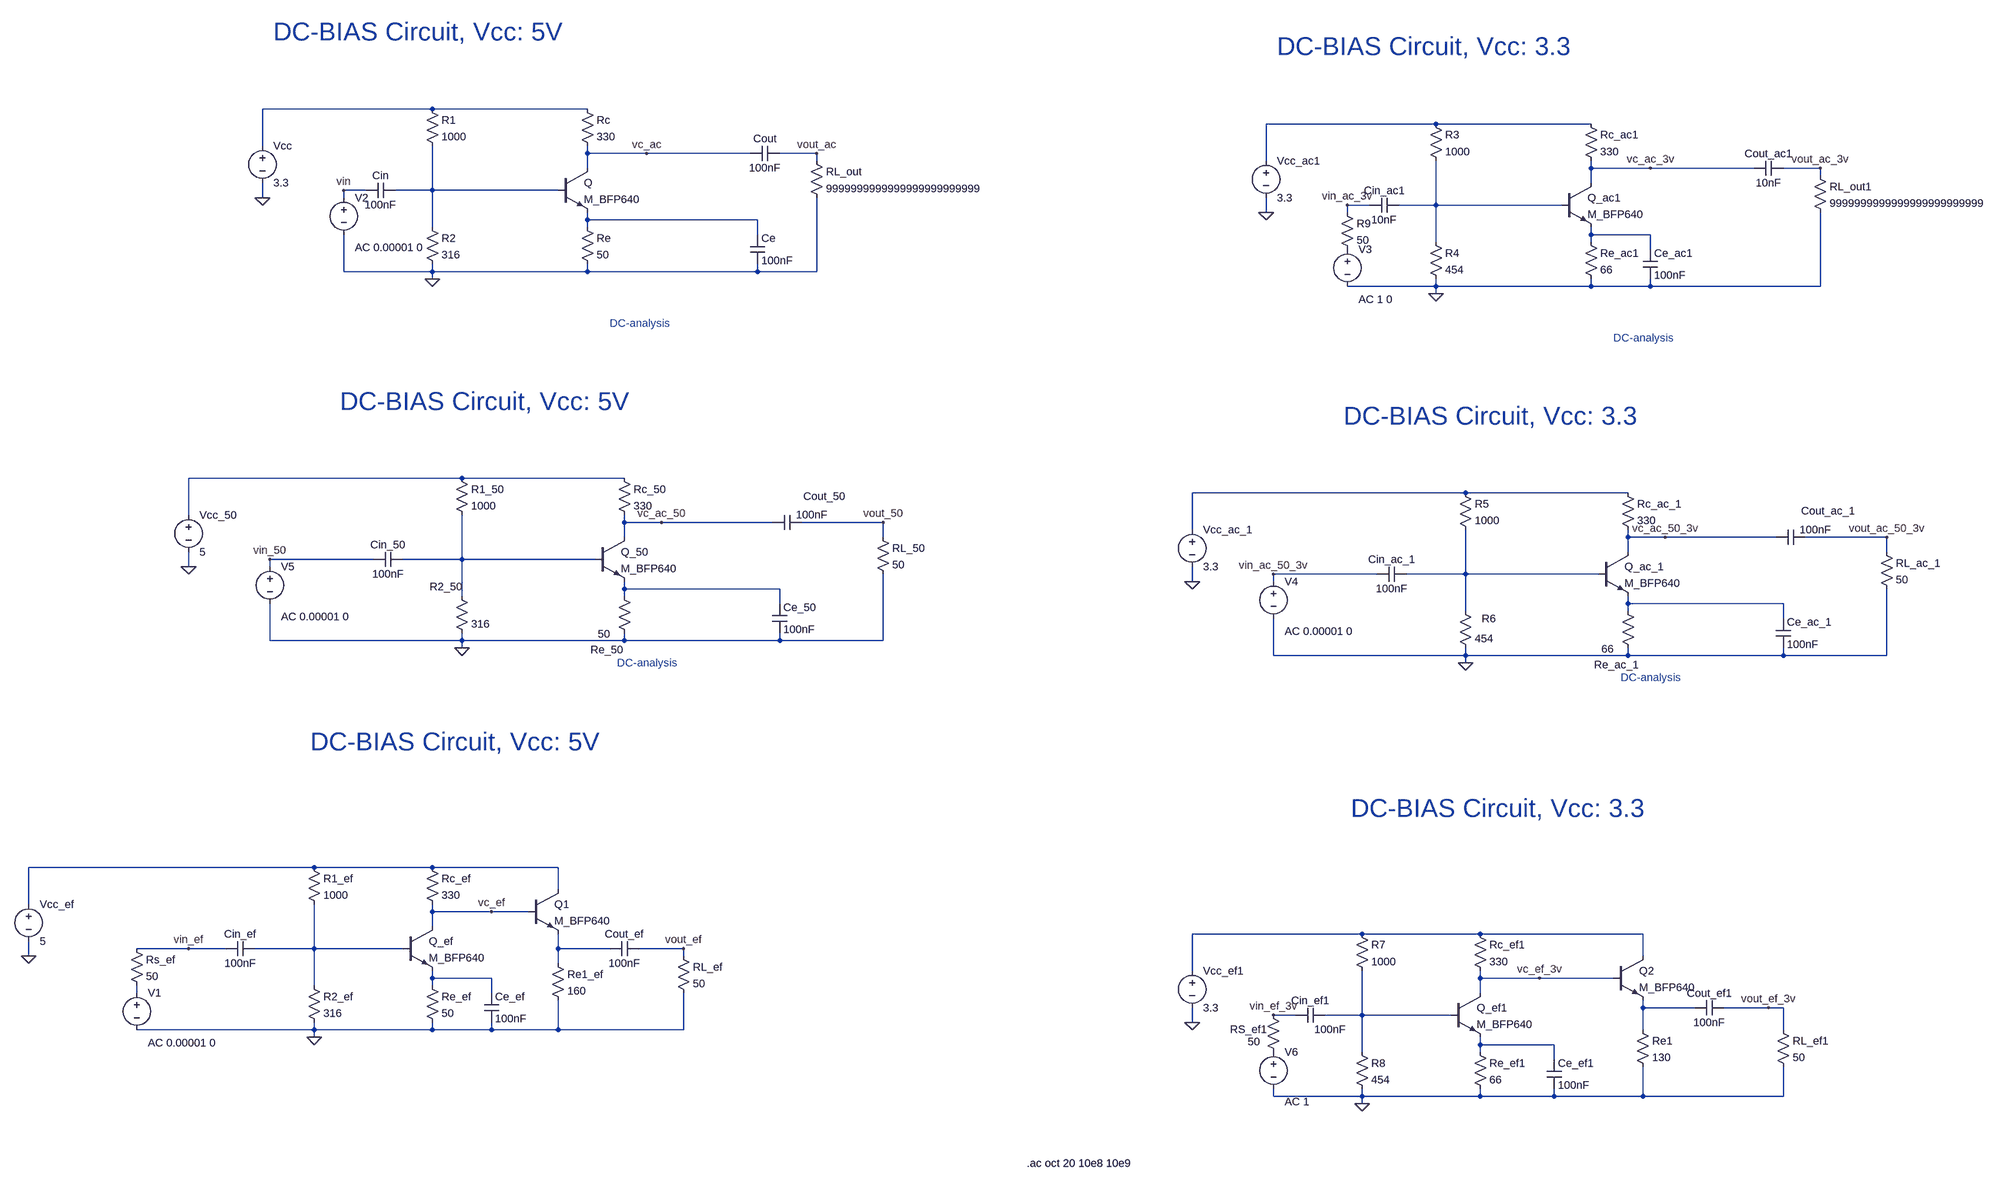
[diagram p0: schematic BP640_FREQ.asc]
BP640_FREQ.asc, the LTspice schematic file:
Version 4
SHEET 1 2820 2688
WIRE -2048 -608 -2416 -608
WIRE -1712 -608 -2048 -608
WIRE 1632 -576 1264 -576
WIRE 1968 -576 1632 -576
WIRE -2416 -528 -2416 -608
WIRE -1712 -512 -1712 -528
WIRE -1584 -512 -1712 -512
WIRE -1360 -512 -1584 -512
WIRE -1216 -512 -1296 -512
WIRE -1216 -496 -1216 -512
WIRE 1264 -496 1264 -576
WIRE -1712 -480 -1712 -512
WIRE 1968 -480 1968 -496
WIRE 2096 -480 1968 -480
WIRE 2320 -480 2096 -480
WIRE 2464 -480 2384 -480
WIRE 2464 -464 2464 -480
WIRE 1968 -448 1968 -480
WIRE -2192 -432 -2240 -432
WIRE -2048 -432 -2048 -528
WIRE -2048 -432 -2128 -432
WIRE -1776 -432 -2048 -432
WIRE -2416 -416 -2416 -448
WIRE -2240 -416 -2240 -432
WIRE 1488 -400 1440 -400
WIRE 1632 -400 1632 -496
WIRE 1632 -400 1552 -400
WIRE 1904 -400 1632 -400
WIRE 1264 -384 1264 -416
WIRE 1440 -384 1440 -400
WIRE -1712 -368 -1712 -384
WIRE -1344 -368 -1712 -368
WIRE -2048 -352 -2048 -432
WIRE -1712 -352 -1712 -368
WIRE -1344 -336 -1344 -368
WIRE 1968 -336 1968 -352
WIRE 2096 -336 1968 -336
WIRE 1632 -320 1632 -400
WIRE 1968 -320 1968 -336
WIRE 2096 -304 2096 -336
WIRE -2240 -256 -2240 -336
WIRE -2048 -256 -2048 -272
WIRE -2048 -256 -2240 -256
WIRE -1712 -256 -1712 -272
WIRE -1712 -256 -2048 -256
WIRE -1344 -256 -1344 -272
WIRE -1344 -256 -1712 -256
WIRE -1216 -256 -1216 -416
WIRE -1216 -256 -1344 -256
WIRE -2048 -240 -2048 -256
WIRE 1632 -224 1632 -240
WIRE 1632 -224 1440 -224
WIRE 1968 -224 1968 -240
WIRE 1968 -224 1632 -224
WIRE 2096 -224 2096 -240
WIRE 2096 -224 1968 -224
WIRE 2464 -224 2464 -384
WIRE 2464 -224 2096 -224
WIRE 1632 -208 1632 -224
WIRE -1984 720 -2576 720
WIRE -1632 720 -1984 720
WIRE 1696 752 1104 752
WIRE 2048 752 1696 752
WIRE -2576 800 -2576 720
WIRE -1632 816 -1632 800
WIRE -1552 816 -1632 816
WIRE -1312 816 -1552 816
WIRE -1072 816 -1248 816
WIRE 1104 832 1104 752
WIRE -1632 848 -1632 816
WIRE -1072 848 -1072 816
WIRE 2048 848 2048 832
WIRE 2128 848 2048 848
WIRE 2368 848 2128 848
WIRE 2608 848 2432 848
WIRE 2048 880 2048 848
WIRE 2608 880 2608 848
WIRE -2176 896 -2400 896
WIRE -1984 896 -1984 800
WIRE -1984 896 -2112 896
WIRE -1696 896 -1984 896
WIRE -2576 912 -2576 880
WIRE -2400 912 -2400 896
WIRE 1504 928 1280 928
WIRE 1696 928 1696 832
WIRE 1696 928 1568 928
WIRE 1984 928 1696 928
WIRE 1104 944 1104 912
WIRE 1280 944 1280 928
WIRE -1632 960 -1632 944
WIRE -1296 960 -1632 960
WIRE -1984 976 -1984 896
WIRE -1632 976 -1632 960
WIRE -1296 992 -1296 960
WIRE 2048 992 2048 976
WIRE 2384 992 2048 992
WIRE 1696 1008 1696 928
WIRE 2048 1008 2048 992
WIRE 2384 1024 2384 992
WIRE -2400 1072 -2400 992
WIRE -1984 1072 -1984 1056
WIRE -1984 1072 -2400 1072
WIRE -1632 1072 -1632 1056
WIRE -1632 1072 -1984 1072
WIRE -1296 1072 -1296 1056
WIRE -1296 1072 -1632 1072
WIRE -1072 1072 -1072 928
WIRE -1072 1072 -1296 1072
WIRE -1984 1088 -1984 1072
WIRE 1280 1104 1280 1024
WIRE 1696 1104 1696 1088
WIRE 1696 1104 1280 1104
WIRE 2048 1104 2048 1088
WIRE 2048 1104 1696 1104
WIRE 2384 1104 2384 1088
WIRE 2384 1104 2048 1104
WIRE 2608 1104 2608 960
WIRE 2608 1104 2384 1104
WIRE 1696 1120 1696 1104
WIRE -2304 1680 -2944 1680
WIRE -2048 1680 -2304 1680
WIRE -1776 1680 -2048 1680
WIRE -1776 1728 -1776 1680
WIRE -2944 1760 -2944 1680
WIRE -2048 1776 -2048 1760
WIRE -1920 1776 -2048 1776
WIRE -1840 1776 -1920 1776
WIRE -2048 1808 -2048 1776
WIRE 1472 1824 1104 1824
WIRE 1728 1824 1472 1824
WIRE 2080 1824 1728 1824
WIRE -2576 1856 -2688 1856
WIRE -2496 1856 -2576 1856
WIRE -2304 1856 -2304 1760
WIRE -2304 1856 -2432 1856
WIRE -2112 1856 -2304 1856
WIRE -1776 1856 -1776 1824
WIRE -1664 1856 -1776 1856
WIRE -1504 1856 -1600 1856
WIRE -2944 1872 -2944 1840
WIRE -1504 1872 -1504 1856
WIRE 2080 1872 2080 1824
WIRE -1776 1888 -1776 1856
WIRE 1104 1904 1104 1824
WIRE -2048 1920 -2048 1904
WIRE -1920 1920 -2048 1920
WIRE 1728 1920 1728 1904
WIRE 1856 1920 1728 1920
WIRE 2016 1920 1856 1920
WIRE -2304 1936 -2304 1856
WIRE -2048 1936 -2048 1920
WIRE -2688 1952 -2688 1936
WIRE -1920 1952 -1920 1920
WIRE 1728 1952 1728 1920
WIRE 2080 1984 2080 1968
WIRE 2192 1984 2080 1984
WIRE 2352 1984 2256 1984
WIRE 2384 1984 2352 1984
WIRE 1328 2000 1280 2000
WIRE 1472 2000 1472 1904
WIRE 1472 2000 1392 2000
WIRE 1664 2000 1472 2000
WIRE 1104 2016 1104 1984
WIRE -2304 2032 -2304 2016
WIRE -2304 2032 -2688 2032
WIRE -2048 2032 -2048 2016
WIRE -2048 2032 -2304 2032
WIRE -1920 2032 -1920 2016
WIRE -1920 2032 -2048 2032
WIRE -1776 2032 -1776 1968
WIRE -1776 2032 -1920 2032
WIRE -1504 2032 -1504 1952
WIRE -1504 2032 -1776 2032
WIRE 2080 2032 2080 1984
WIRE 2384 2032 2384 1984
WIRE -2304 2048 -2304 2032
WIRE 1728 2064 1728 2048
WIRE 1888 2064 1728 2064
WIRE 1472 2080 1472 2000
WIRE 1728 2080 1728 2064
WIRE 1888 2096 1888 2064
WIRE 1280 2176 1280 2160
WIRE 1472 2176 1472 2160
WIRE 1472 2176 1280 2176
WIRE 1728 2176 1728 2160
WIRE 1728 2176 1472 2176
WIRE 1888 2176 1888 2160
WIRE 1888 2176 1728 2176
WIRE 2080 2176 2080 2112
WIRE 2080 2176 1888 2176
WIRE 2384 2176 2384 2112
WIRE 2384 2176 2080 2176
WIRE 1472 2192 1472 2176
FLAG -2416 -416 0
FLAG -2048 -240 0
FLAG -2576 912 0
FLAG -1984 1088 0
FLAG -2400 896 vin_50
FLAG -1072 816 vout_50
FLAG -2240 -432 vin
FLAG -1216 -512 vout_ac
FLAG -1584 -512 vc_ac
FLAG -1552 816 vc_ac_50
FLAG -2944 1872 0
FLAG -2304 2048 0
FLAG -2576 1856 vin_ef
FLAG -1504 1856 vout_ef
FLAG -1920 1776 vc_ef
FLAG 1264 -384 0
FLAG 1632 -208 0
FLAG 1104 944 0
FLAG 1696 1120 0
FLAG 1280 928 vin_ac_50_3v
FLAG 2608 848 vout_ac_50_3v
FLAG 1440 -400 vin_ac_3v
FLAG 2464 -480 vout_ac_3v
FLAG 2096 -480 vc_ac_3v
FLAG 2128 848 vc_ac_50_3v
FLAG 1104 2016 0
FLAG 1472 2192 0
FLAG 1280 2000 vin_ef_3v
FLAG 1856 1920 vc_ef_3v
FLAG 2352 1984 vout_ef_3v
DATAFLAG -1632 816 ""
DATAFLAG -1632 832 ""
DATAFLAG 2048 848 ""
DATAFLAG 2048 864 ""
DATAFLAG 2288 -400 ""
SYMBOL voltage -2240 -432 R0
WINDOW 123 24 124 Left 2
WINDOW 39 0 0 Left 0
SYMATTR Value2 AC 0.00001 0
SYMATTR InstName V2
SYMATTR Value ""
SYMBOL voltage -2416 -544 R0
WINDOW 123 0 0 Left 0
WINDOW 39 0 0 Left 0
SYMATTR InstName Vcc
SYMATTR Value 3.3
SYMBOL npn -1776 -480 R0
SYMATTR InstName Q
SYMATTR Value M_BFP640
SYMBOL res -2064 -624 R0
SYMATTR InstName R1
SYMATTR Value 1000
SYMBOL res -2064 -368 R0
SYMATTR InstName R2
SYMATTR Value 316
SYMBOL res -1728 -368 R0
SYMATTR InstName Re
SYMATTR Value 50
SYMBOL res -1728 -624 R0
SYMATTR InstName Rc
SYMATTR Value 330
SYMBOL res -1232 -512 R0
SYMATTR InstName RL_out
SYMATTR Value 9999999999999999999999999
SYMBOL cap -1360 -336 R0
SYMATTR InstName Ce
SYMATTR Value 100nF
SYMBOL cap -1296 -528 R90
WINDOW 0 0 32 VBottom 2
WINDOW 3 32 32 VTop 2
SYMATTR InstName Cout
SYMATTR Value 100nF
SYMBOL cap -2128 -448 R90
WINDOW 0 0 32 VBottom 2
WINDOW 3 32 32 VTop 2
SYMATTR InstName Cin
SYMATTR Value 100nF
SYMBOL voltage -2576 784 R0
WINDOW 123 0 0 Left 0
WINDOW 39 0 0 Left 0
SYMATTR InstName Vcc_50
SYMATTR Value 5
SYMBOL npn -1696 848 R0
SYMATTR InstName Q_50
SYMATTR Value M_BFP640
SYMBOL res -2000 704 R0
SYMATTR InstName R1_50
SYMATTR Value 1000
SYMBOL res -2000 960 R0
WINDOW 0 -54 -5 Left 2
SYMATTR InstName R2_50
SYMATTR Value 316
SYMBOL res -1648 960 R0
WINDOW 0 -58 132 Left 2
WINDOW 3 -42 98 Left 2
SYMATTR InstName Re_50
SYMATTR Value 50
SYMBOL res -1648 704 R0
SYMATTR InstName Rc_50
SYMATTR Value 330
SYMBOL res -1088 832 R0
SYMATTR InstName RL_50
SYMATTR Value 50
SYMBOL cap -1312 992 R0
SYMATTR InstName Ce_50
SYMATTR Value 100nF
SYMBOL cap -1248 800 R90
WINDOW 0 -25 -49 VBottom 2
WINDOW 3 -16 -22 VTop 2
SYMATTR InstName Cout_50
SYMATTR Value 100nF
SYMBOL cap -2112 880 R90
WINDOW 0 0 32 VBottom 2
WINDOW 3 32 32 VTop 2
SYMATTR InstName Cin_50
SYMATTR Value 100nF
SYMBOL voltage -2400 896 R0
WINDOW 123 24 124 Left 2
WINDOW 39 0 0 Left 0
SYMATTR Value2 AC 0.00001 0
SYMATTR InstName V5
SYMATTR Value ""
SYMBOL voltage -2944 1744 R0
WINDOW 123 0 0 Left 0
WINDOW 39 0 0 Left 0
SYMATTR InstName Vcc_ef
SYMATTR Value 5
SYMBOL npn -2112 1808 R0
SYMATTR InstName Q_ef
SYMATTR Value M_BFP640
SYMBOL res -2320 1664 R0
SYMATTR InstName R1_ef
SYMATTR Value 1000
SYMBOL res -2320 1920 R0
SYMATTR InstName R2_ef
SYMATTR Value 316
SYMBOL res -2064 1920 R0
SYMATTR InstName Re_ef
SYMATTR Value 50
SYMBOL res -2064 1664 R0
SYMATTR InstName Rc_ef
SYMATTR Value 330
SYMBOL res -1520 1856 R0
SYMATTR InstName RL_ef
SYMATTR Value 50
SYMBOL cap -1936 1952 R0
SYMATTR InstName Ce_ef
SYMATTR Value 100nF
SYMBOL cap -1600 1840 R90
WINDOW 0 0 32 VBottom 2
WINDOW 3 32 32 VTop 2
SYMATTR InstName Cout_ef
SYMATTR Value 100nF
SYMBOL cap -2432 1840 R90
WINDOW 0 0 32 VBottom 2
WINDOW 3 32 32 VTop 2
SYMATTR InstName Cin_ef
SYMATTR Value 100nF
SYMBOL npn -1840 1728 R0
SYMATTR InstName Q1
SYMATTR Value M_BFP640
SYMBOL res -1792 1872 R0
SYMATTR InstName Re1_ef
SYMATTR Value 160
SYMBOL voltage -2688 1936 R0
WINDOW 123 24 124 Left 2
WINDOW 39 0 0 Left 0
SYMATTR Value2 AC 0.00001 0
SYMATTR InstName V1
SYMATTR Value ""
SYMBOL res -2704 1840 R0
SYMATTR InstName Rs_ef
SYMATTR Value 50
SYMBOL voltage 1440 -320 R0
WINDOW 123 24 124 Left 2
WINDOW 39 0 0 Left 0
SYMATTR Value2 AC 1 0
SYMATTR InstName V3
SYMATTR Value ""
SYMBOL voltage 1264 -512 R0
WINDOW 123 0 0 Left 0
WINDOW 39 0 0 Left 0
SYMATTR InstName Vcc_ac1
SYMATTR Value 3.3
SYMBOL npn 1904 -448 R0
SYMATTR InstName Q_ac1
SYMATTR Value M_BFP640
SYMBOL res 1616 -592 R0
SYMATTR InstName R3
SYMATTR Value 1000
SYMBOL res 1616 -336 R0
SYMATTR InstName R4
SYMATTR Value 454
SYMBOL res 1952 -336 R0
SYMATTR InstName Re_ac1
SYMATTR Value 66
SYMBOL res 1952 -592 R0
SYMATTR InstName Rc_ac1
SYMATTR Value 330
SYMBOL res 2448 -480 R0
SYMATTR InstName RL_out1
SYMATTR Value 9999999999999999999999999
SYMBOL cap 2384 -496 R90
WINDOW 0 0 32 VBottom 2
WINDOW 3 32 32 VTop 2
SYMATTR InstName Cout_ac1
SYMATTR Value 10nF
SYMBOL cap 1552 -416 R90
WINDOW 0 0 32 VBottom 2
WINDOW 3 32 32 VTop 2
SYMATTR InstName Cin_ac1
SYMATTR Value 10nF
SYMBOL voltage 1104 816 R0
WINDOW 123 0 0 Left 0
WINDOW 39 0 0 Left 0
SYMATTR InstName Vcc_ac_1
SYMATTR Value 3.3
SYMBOL npn 1984 880 R0
SYMATTR InstName Q_ac_1
SYMATTR Value M_BFP640
SYMBOL res 1680 736 R0
SYMATTR InstName R5
SYMATTR Value 1000
SYMBOL res 1680 992 R0
WINDOW 0 51 32 Left 2
SYMATTR InstName R6
SYMATTR Value 454
SYMBOL res 2032 992 R0
WINDOW 0 -58 132 Left 2
WINDOW 3 -42 98 Left 2
SYMATTR InstName Re_ac_1
SYMATTR Value 66
SYMBOL res 2032 736 R0
SYMATTR InstName Rc_ac_1
SYMATTR Value 330
SYMBOL res 2592 864 R0
SYMATTR InstName RL_ac_1
SYMATTR Value 50
SYMBOL cap 2368 1024 R0
SYMATTR InstName Ce_ac_1
SYMATTR Value 100nF
SYMBOL cap 2432 832 R90
WINDOW 0 -25 -49 VBottom 2
WINDOW 3 -16 -22 VTop 2
SYMATTR InstName Cout_ac_1
SYMATTR Value 100nF
SYMBOL cap 1568 912 R90
WINDOW 0 0 32 VBottom 2
WINDOW 3 32 32 VTop 2
SYMATTR InstName Cin_ac_1
SYMATTR Value 100nF
SYMBOL voltage 1280 928 R0
WINDOW 123 24 124 Left 2
WINDOW 39 0 0 Left 0
SYMATTR Value2 AC 0.00001 0
SYMATTR InstName V4
SYMATTR Value ""
SYMBOL voltage 1104 1888 R0
WINDOW 123 0 0 Left 0
WINDOW 39 0 0 Left 0
SYMATTR InstName Vcc_ef1
SYMATTR Value 3.3
SYMBOL npn 1664 1952 R0
SYMATTR InstName Q_ef1
SYMATTR Value M_BFP640
SYMBOL res 1456 1808 R0
SYMATTR InstName R7
SYMATTR Value 1000
SYMBOL res 1456 2064 R0
SYMATTR InstName R8
SYMATTR Value 454
SYMBOL res 1712 2064 R0
SYMATTR InstName Re_ef1
SYMATTR Value 66
SYMBOL res 1712 1808 R0
SYMATTR InstName Rc_ef1
SYMATTR Value 330
SYMBOL cap 1872 2096 R0
SYMATTR InstName Ce_ef1
SYMATTR Value 100nF
SYMBOL cap 1392 1984 R90
WINDOW 0 0 32 VBottom 2
WINDOW 3 31 -11 VTop 2
SYMATTR InstName Cin_ef1
SYMATTR Value 100nF
SYMBOL npn 2016 1872 R0
SYMATTR InstName Q2
SYMATTR Value M_BFP640
SYMBOL res 2064 2016 R0
SYMATTR InstName Re1
SYMATTR Value 130
SYMBOL cap 2256 1968 R90
WINDOW 0 0 32 VBottom 2
WINDOW 3 32 32 VTop 2
SYMATTR InstName Cout_ef1
SYMATTR Value 100nF
SYMBOL res 2368 2016 R0
SYMATTR InstName RL_ef1
SYMATTR Value 50
SYMBOL res 1264 1984 R0
WINDOW 0 -78 47 Left 2
WINDOW 3 -40 74 Left 2
SYMATTR InstName RS_ef1
SYMATTR Value 50
SYMBOL voltage 1280 2064 R0
WINDOW 123 24 124 Left 2
WINDOW 39 0 0 Left 0
SYMATTR Value2 AC 1
SYMATTR InstName V6
SYMATTR Value ""
SYMBOL res 1424 -400 R0
SYMATTR InstName R9
SYMATTR Value 50
SYMBOL cap 2080 -304 R0
SYMATTR InstName Ce_ac1
SYMATTR Value 100nF
TEXT -1664 -144 Left 2 ;DC-analysis
TEXT -2392 -936 Left 5 ;DC-BIAS Circuit, Vcc: 5V
TEXT -1648 1120 Left 2 ;DC-analysis
TEXT -2248 440 Left 5 ;DC-BIAS Circuit, Vcc: 5V
TEXT 696 2424 Left 2 !.ac oct 20 10e8 10e9
TEXT -2312 1408 Left 5 ;DC-BIAS Circuit, Vcc: 5V
TEXT 2016 -112 Left 2 ;DC-analysis
TEXT 1288 -904 Left 5 ;DC-BIAS Circuit, Vcc: 3.3
TEXT 2032 1152 Left 2 ;DC-analysis
TEXT 1432 472 Left 5 ;DC-BIAS Circuit, Vcc: 3.3
TEXT 1448 1552 Left 5 ;DC-BIAS Circuit, Vcc: 3.3

The netlist it stands for:
* BP640_FREQ.asc
V2 vin 0 AC 0.00001 0
Vcc N001 0 3.3
Q vc_ac N003 N005 0 M_BFP640
R1 N001 N003 1000
R2 N003 0 316
Re N005 0 50
Rc N001 vc_ac 330
RL_out vout_ac 0 9999999999999999999999999
Ce N005 0 100nF
Cout vout_ac vc_ac 100nF
Cin N003 vin 100nF
Vcc_50 N007 0 5
Q_50 vc_ac_50 N009 N011 0 M_BFP640
R1_50 N007 N009 1000
R2_50 N009 0 316
Re_50 N011 0 50
Rc_50 N007 vc_ac_50 330
RL_50 vout_50 0 50
Ce_50 N011 0 100nF
Cout_50 vout_50 vc_ac_50 100nF
Cin_50 N009 vin_50 100nF
V5 vin_50 0 AC 0.00001 0
Vcc_ef N013 0 5
Q_ef vc_ef N015 N017 0 M_BFP640
R1_ef N013 N015 1000
R2_ef N015 0 316
Re_ef N017 0 50
Rc_ef N013 vc_ef 330
RL_ef vout_ef 0 50
Ce_ef N017 0 100nF
Cout_ef vout_ef N016 100nF
Cin_ef N015 vin_ef 100nF
Q1 N013 vc_ef N016 0 M_BFP640
Re1_ef N016 0 160
V1 N018 0 AC 0.00001 0
Rs_ef vin_ef N018 50
V3 P001 0 AC 1 0
Vcc_ac1 N002 0 3.3
Q_ac1 vc_ac_3v N004 N006 0 M_BFP640
R3 N002 N004 1000
R4 N004 0 454
Re_ac1 N006 0 66
Rc_ac1 N002 vc_ac_3v 330
RL_out1 vout_ac_3v 0 9999999999999999999999999
Cout_ac1 vout_ac_3v vc_ac_3v 10nF
Cin_ac1 N004 vin_ac_3v 10nF
Vcc_ac_1 N008 0 3.3
Q_ac_1 vc_ac_50_3v N010 N012 0 M_BFP640
R5 N008 N010 1000
R6 N010 0 454
Re_ac_1 N012 0 66
Rc_ac_1 N008 vc_ac_50_3v 330
RL_ac_1 vout_ac_50_3v 0 50
Ce_ac_1 N012 0 100nF
Cout_ac_1 vout_ac_50_3v vc_ac_50_3v 100nF
Cin_ac_1 N010 vin_ac_50_3v 100nF
V4 vin_ac_50_3v 0 AC 0.00001 0
Vcc_ef1 N014 0 3.3
Q_ef1 vc_ef_3v N020 N021 0 M_BFP640
R7 N014 N020 1000
R8 N020 0 454
Re_ef1 N021 0 66
Rc_ef1 N014 vc_ef_3v 330
Ce_ef1 N021 0 100nF
Cin_ef1 N020 vin_ef_3v 100nF
Q2 N014 vc_ef_3v N019 0 M_BFP640
Re1 N019 0 130
Cout_ef1 vout_ef_3v N019 100nF
RL_ef1 vout_ef_3v 0 50
RS_ef1 vin_ef_3v P002 50
V6 P002 0 AC 1
R9 vin_ac_3v P001 50
Ce_ac1 N006 0 100nF
.model NPN NPN
.model PNP PNP
.lib standard.bjt
* DC-analysis
* DC-BIAS Circuit, Vcc: 5V
* DC-analysis
* DC-BIAS Circuit, Vcc: 5V
.ac oct 20 10e8 10e9
* DC-BIAS Circuit, Vcc: 5V
* DC-analysis
* DC-BIAS Circuit, Vcc: 3.3
* DC-analysis
* DC-BIAS Circuit, Vcc: 3.3
* DC-BIAS Circuit, Vcc: 3.3
.backanno
.end